# EAGLE design helmet_blinker_light_ACY_v0.1 (EAGLE 7.6.0)
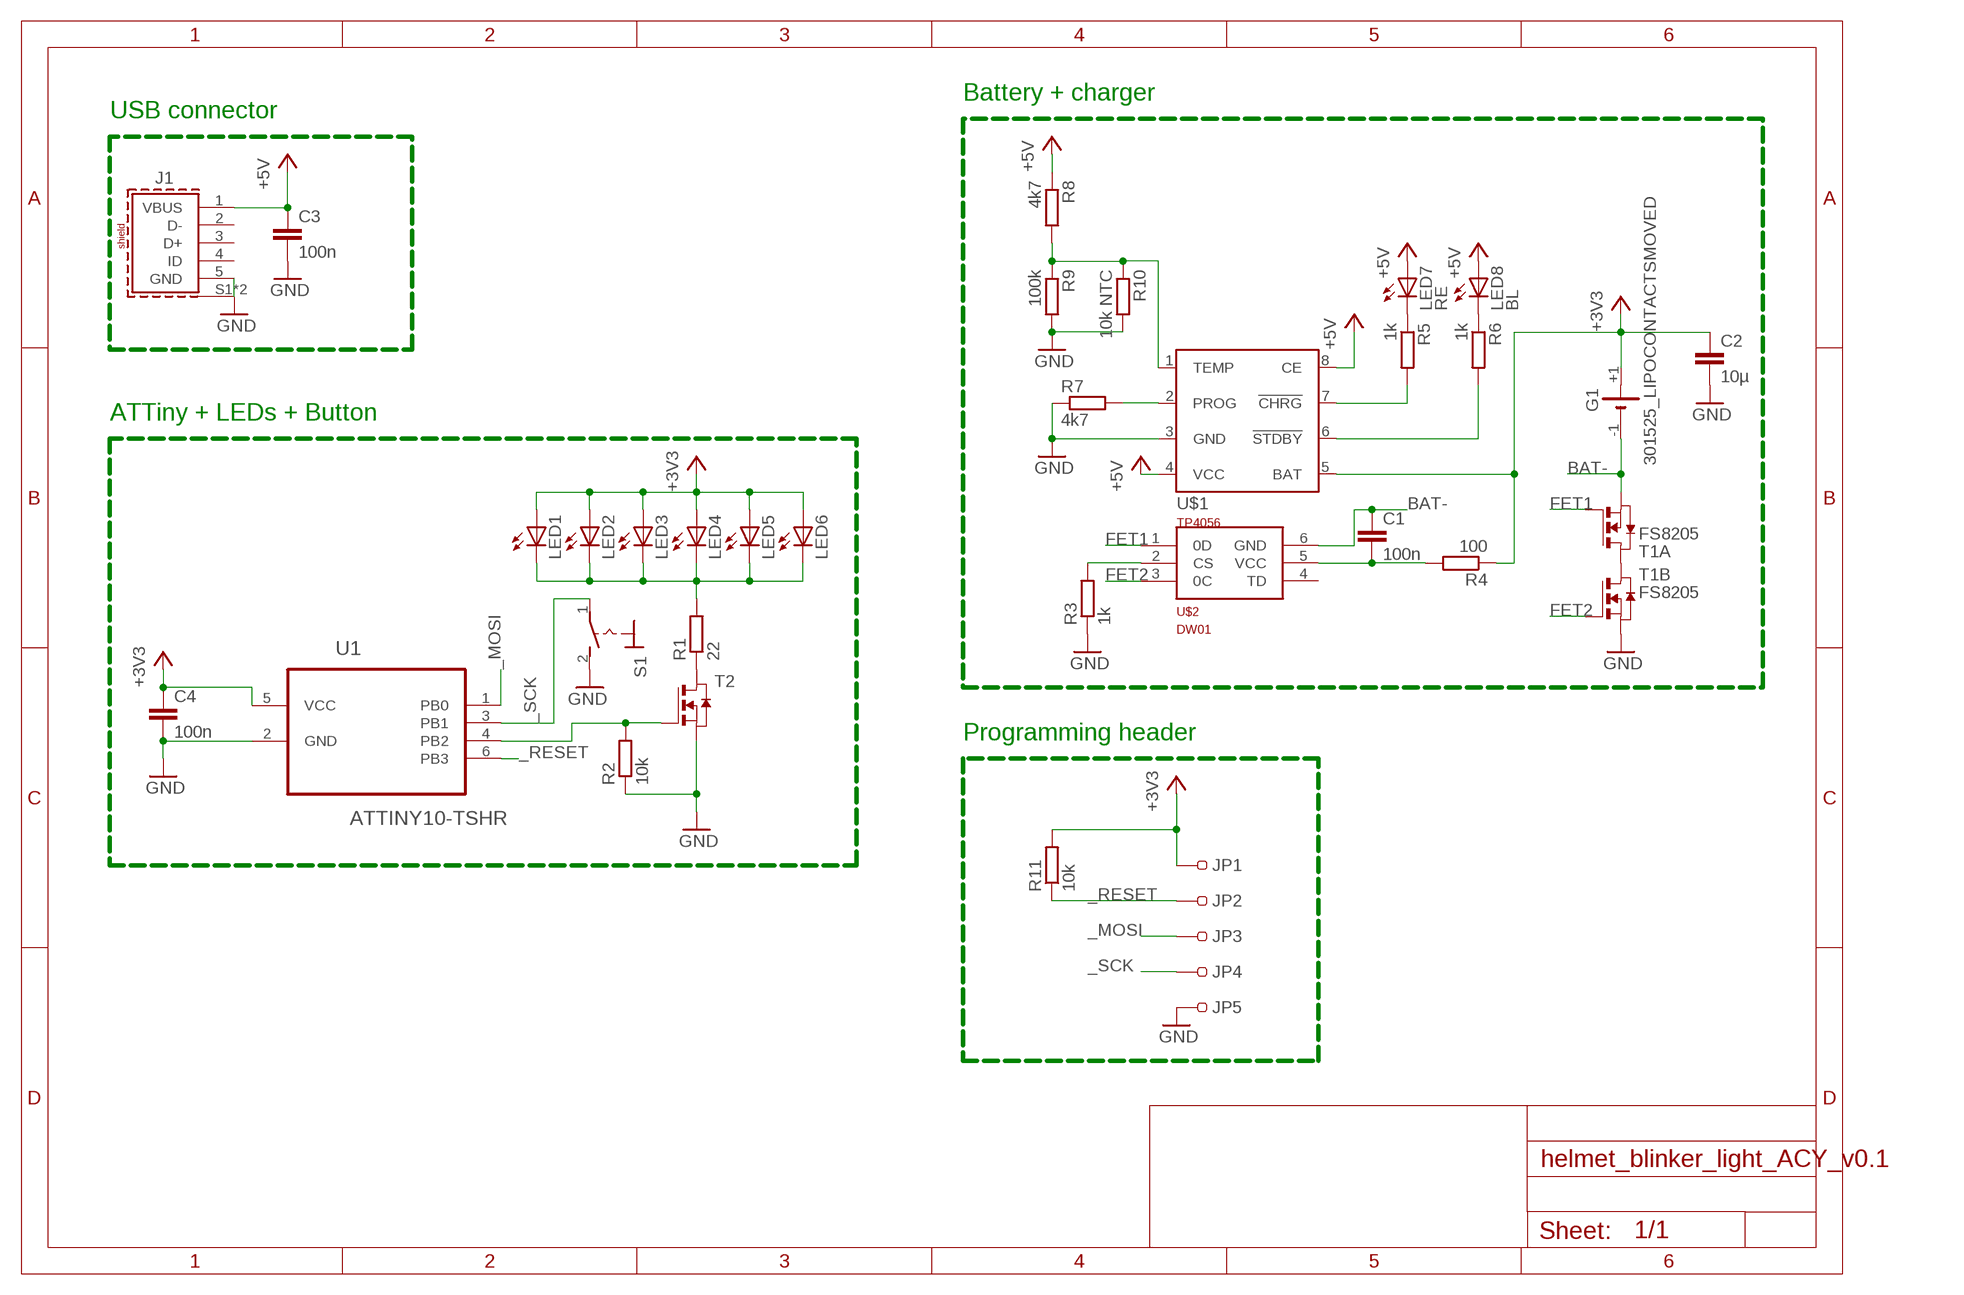
[diagram p0: schematic, sheet 1]

## Parts
C1  100n  C-EUC0402K  [C0402K]
C2  10µ  C-EUC0805K  [C0805K]
C3  100n  C-EUC0402K  [C0402K]
C4  100n  C-EUC0402K  [C0402K]
G1  301525_LIPOCONTACTSMOVED  [301525_LIPO_CONTACTSMOVED]
J1  614105150621  [614105150621]
JP1  0.7MM_POGO-PINS  [0.7MM_POGO-PINS]
JP2  0.7MM_POGO-PINS  [0.7MM_POGO-PINS]
JP3  0.7MM_POGO-PINS  [0.7MM_POGO-PINS]
JP4  0.7MM_POGO-PINS  [0.7MM_POGO-PINS]
JP5  0.7MM_POGO-PINS  [0.7MM_POGO-PINS]
LED1  LEDCHIPLED_0805  [CHIPLED_0805]
LED2  LEDCHIPLED_0805  [CHIPLED_0805]
LED3  LEDCHIPLED_0805  [CHIPLED_0805]
LED4  LEDCHIPLED_0805  [CHIPLED_0805]
LED5  LEDCHIPLED_0805  [CHIPLED_0805]
LED6  LEDCHIPLED_0805  [CHIPLED_0805]
LED7  RE  LEDCHIPLED_0603  [CHIPLED_0603]
LED8  BL  LEDCHIPLED_0603  [CHIPLED_0603]
R1  22  R-EU_R0805  [R0805]
R2  10k  R-EU_R0402  [R0402]
R3  1k  R-EU_R0402  [R0402]
R4  100  R-EU_R0402  [R0402]
R5  1k  R-EU_R0402  [R0402]
R6  1k  R-EU_R0402  [R0402]
R7  4k7  R-EU_R0402  [R0402]
R8  4k7  R-EU_R0402  [R0402]
R9  100k  R-EU_R0402  [R0402]
R10  10k NTC  R-EU_R0805  [R0805]
R11  10k  R-EU_R0402  [R0402]
S1  TS-1088  [TS-1088]
T1  FS8205  DMN3024LSD  [TSSOP-8]
T2  NMOSSOT23  [SOT-23]
U1  ATTINY10-TSHR  [SOT95P280X145-6N]
U$1  TP4056ESOP  [ESOP23-8]
U$2  DW01  [SOT23-6]

## Nets
+3V3: C2.1 C4.1 G1.+1(+) JP1.1 LED1.A LED2.A LED3.A LED4.A LED5.A LED6.A R4.1 R11.2 U1.5(VCC) U$1.5(BAT)
+5V: C3.1 J1.1(VBUS) LED7.A LED8.A R8.1 U$1.4(VCC) U$1.8(CE)
_MOSI: JP3.1 U1.1(PB0)
_RESET: JP2.1 R11.1 U1.6(PB3)
_SCK: JP4.1 S1.1(P) U1.3(PB1)
BAT-: C1.1 G1.-1(-) T1.2(A:S) T1.3(A:S) U$2.6(GND)
FET1: T1.4(A:G) U$2.1(0D)
FET2: T1.5(B:G) U$2.3(0C)
GND: C2.2 C3.2 C4.2 J1.5(GND) J1.S1(SHIELD) J1.S2(SHIELD) JP5.1 R2.1 R3.1 R7.1 R9.2 R10.2 S1.2(S) T1.6(B:S) T1.7(B:S) T2.2(S) U1.2(GND) U$1.3(GND)
N$1: T1.1(A:D) T1.8(B:D)
N$2: R1.1 T2.1(D)
N$3: R3.2 U$2.2(CS)
N$4: R2.2 T2.3(G) U1.4(PB2)
N$5: LED1.C LED2.C LED3.C LED4.C LED5.C LED6.C R1.2
N$6: C1.2 R4.2 U$2.5(VCC)
N$8: R7.2 U$1.2(PROG)
N$9: R6.2 U$1.6(!STDBY)
N$10: LED7.C R5.1
N$11: LED8.C R6.1
N$12: R5.2 U$1.7(!CHRG)
N$13: R8.2 R9.1 R10.1 U$1.1(TEMP)
Unconnected: J1.2(D-) J1.3(D+) J1.4(ID) U$2.4(TD)

## Notes on the sheet
- Battery + charger
- USB connector
- ATTiny + LEDs + Button
- Programming header

## Library data of the parts
C1-C4 = rcl:C-EU: CAPACITOR, European symbol
G1 = battery:301525_LIPO: LI BATTERY Sonnenschein
J1 = 632723300011_Eagle_WR-USB_rev20a:614105150621: WR-COM Micro USB 2.0 Type AB Vertical 5 Contacts Kind Properties Durability:10 000 Mating cycles Quality Class:10 000 Mating cycles Connector Type:Micro USB Gender:Receptacle Type:Vertical General Information Operating Temperature:-40up to +105 °C Compliance:RoHS Electrical Properties IR 1:1.8A Working Voltage:30V (AC) Withstanding Voltage:100V (AC) Contact Resistance:30 mΩ Material Properties Insulator Material:LCP Insulator Flammability Rating:UL94 V-0 Color:Black Contact Material:Copper Alloy Contact Plating: Gold Contact Type:Stamped Shielding Material:Stainless Steel Shielding Plating:Matte Tin <https://www.we-online.com/catalog/media/o33043v209%20Family_WR-COM_Micro-USB_Type-AB_614105150621.jpg> Details see: https://www.we-online.com/catalog/en/COM_MICRO_TYPE_AB_VERTICAL/ Updated by Yingchun, Shan 2020-01-16 2020 (C) Würth Elektronik; APPLICATION: Micro USB 2.0; DATASHEET-URL: https://www.we-online.com/catalog/datasheet/614105150621.pdf; GERDER: Receptacle; INTERFACE-TYPE: TypeAB; IR1: 1.8A; MOUNT: THT; PACKAGING: Tape and Reel; PART-NUMBER: 614105150621; PINS: 5; TYPE: Vertical; WORKING-VOLTAGE: 30V(AC)
JP1-JP5 = pinhead:0.7MM_POGO-PINS: PIN HEADER
LED1-LED8 = led:LED: LED OSRAM: - CHIPLED LG R971, LG N971, LY N971, LG Q971, LY Q971, LO R971, LY R971 LH N974, LH R974 LS Q976, LO Q976, LY Q976 LO Q996 - Hyper CHIPLED LW Q18S LB Q993, LB Q99A, LB R99A - SideLED LS A670, LO A670, LY A670, LG A670, LP A670 LB A673, LV A673, LT A673, LW A673 LH A674 LY A675 LS A676, LA A676, LO A676, LY A676, LW A676 LS A679, LY A679, LG A679 - Hyper Micro SIDELED® LS Y876, LA Y876, LO Y876, LY Y876 LT Y87S - SmartLED LW L88C, LW L88S LB L89C, LB L89S, LG L890 LS L89K, LO L89K, LY L89K LS L896, LA L896, LO L896, LY L896 - TOPLED LS T670, LO T670, LY T670, LG T670, LP T670 LSG T670, LSP T670, LSY T670, LOP T670, LYG T670 LG T671, LOG T671, LSG T671 LB T673, LV T673, LT T673, LW T673 LH T674 LS T676, LA T676, LO T676, LY T676, LB T676, LH T676, LSB T676, LW T676 LB T67C, LV T67C, LT T67C, LS T67K, LO T67K, LY T67K, LW E67C LS E67B, LA E67B, LO E67B, LY E67B, LB E67C, LV E67C, LT E67C LW T67C LS T679, LY T679, LG T679 LS T770, LO T770, LY T770, LG T770, LP T770 LB T773, LV T773, LT T773, LW T773 LH T774 LS E675, LA E675, LY E675, LS T675 LS T776, LA T776, LO T776, LY T776, LB T776 LHGB T686 LT T68C, LB T68C - Hyper Mini TOPLED® LB M676 - Mini TOPLED Santana® LG M470 LS M47K, LO M47K, LY M47K Source: http://www.osram.convergy.de LUXEON: - LUMILED® LXK2-PW12-R00, LXK2-PW12-S00, LXK2-PW14-U00, LXK2-PW14-V00 LXK2-PM12-R00, LXK2-PM12-S00, LXK2-PM14-U00 LXK2-PE12-Q00, LXK2-PE12-R00, LXK2-PE12-S00, LXK2-PE14-T00, LXK2-PE14-U00 LXK2-PB12-K00, LXK2-PB12-L00, LXK2-PB12-M00, LXK2-PB14-N00, LXK2-PB14-P00, LXK2-PB14-Q00 LXK2-PR12-L00, LXK2-PR12-M00, LXK2-PR14-Q00, LXK2-PR14-R00 LXK2-PD12-Q00, LXK2-PD12-R00, LXK2-PD12-S00 LXK2-PH12-R00, LXK2-PH12-S00 LXK2-PL12-P00, LXK2-PL12-Q00, LXK2-PL12-R00 Source: www.luxeon.com KINGBRIGHT: KA-3528ASYC Source: www.kingbright.com
R1-R11 = rcl:R-EU_: RESISTOR, European symbol
S1 = switch:TS-1088: TOGGLE SWITCH Button TS-1088 https://lcsc.com/product-detail/Tactile-Switches_XUNPU-TS-1088-AR02016_C720477.html/?href=jlc-SMT https://lcsc.com/product-detail/Tactile-Switches_Korean-Hroparts-Elec-K2-1807SA-B4DW-06_C223822.html LCSC (JLCPCB): C720477 LCSC (JLCPCB): C223822
T1 = FS8205A:DMN3024LSD: DUAL N-CHANNEL ENHANCEMENT MODE MOSFET data sheet <http://goo.gl/dRgboR> Dave.Calaway Eagle Library <https://goo.gl/Muy1Tr>
T2 = zetex:NMOSSOT23: MOS FET; OC_FARNELL: unknown; OC_NEWARK: unknown
U1 = Atmel_By_element14_Batch_1-00:ATTINY10-TSHR: 8-bit Microcontroller with In-System Programmable Flash; MPN: ATTINY10-TSHR; OC_FARNELL: 1748538; OC_NEWARK: 26R5645; PACKAGE: SOT-23-6; SUPPLIER: Atmel
U$1 = TP4056:TP4056: TP4056 Data sheet <http://goo.gl/J7k8TF> Dave.Calaway Eagle Library <https://goo.gl/Muy1Tr>
U$2 = DW01:DW01: The DW01-P battery protection IC is designed to protect lithium-ion/polymer battery from damage or degrading the lifetime due to overcharge, overdischarge, and/or overcurrent for one-cell lithium-ion/polymer battery powered systems, such as cellular phones. Data sheet <http://goo.gl/4y108d> Dave.Calaway Eagle Library <https://goo.gl/Muy1Tr>

## Board
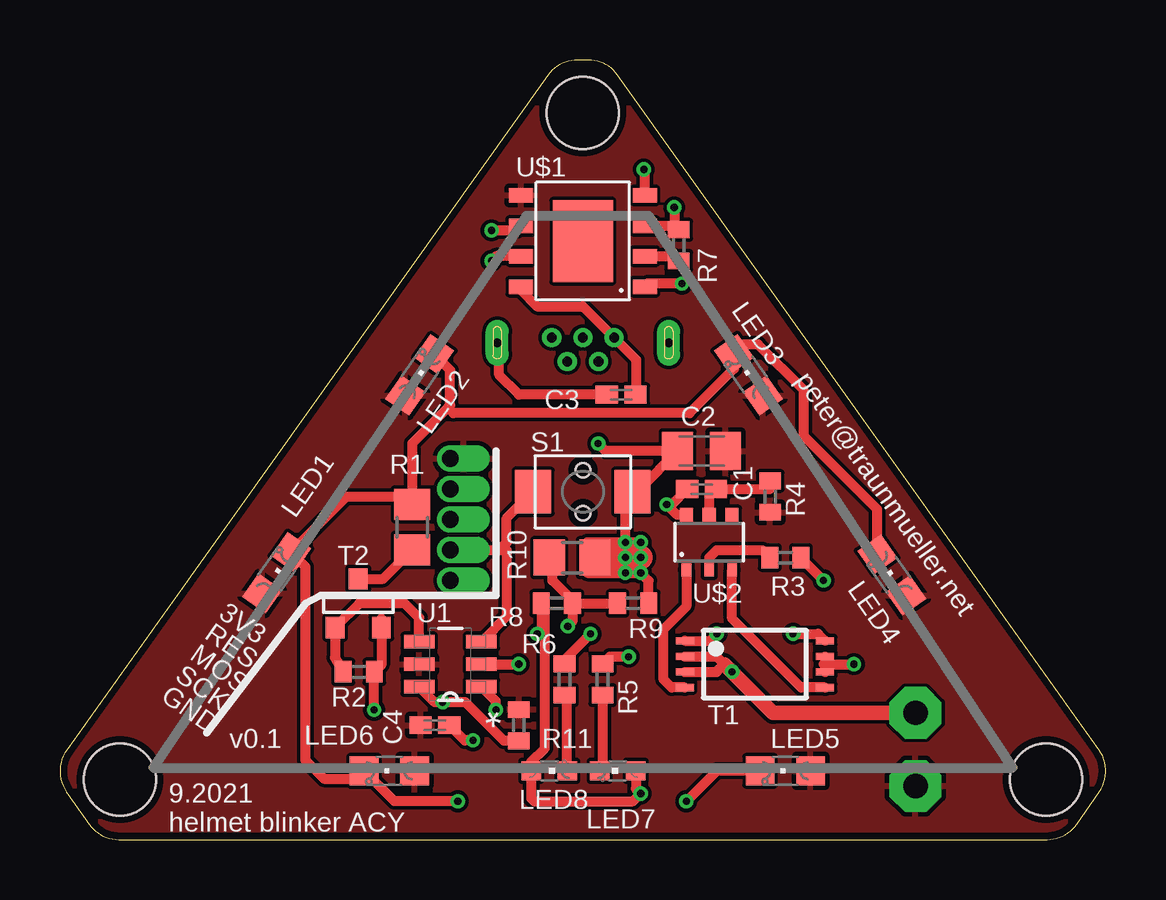
[diagram p1: board, top side]
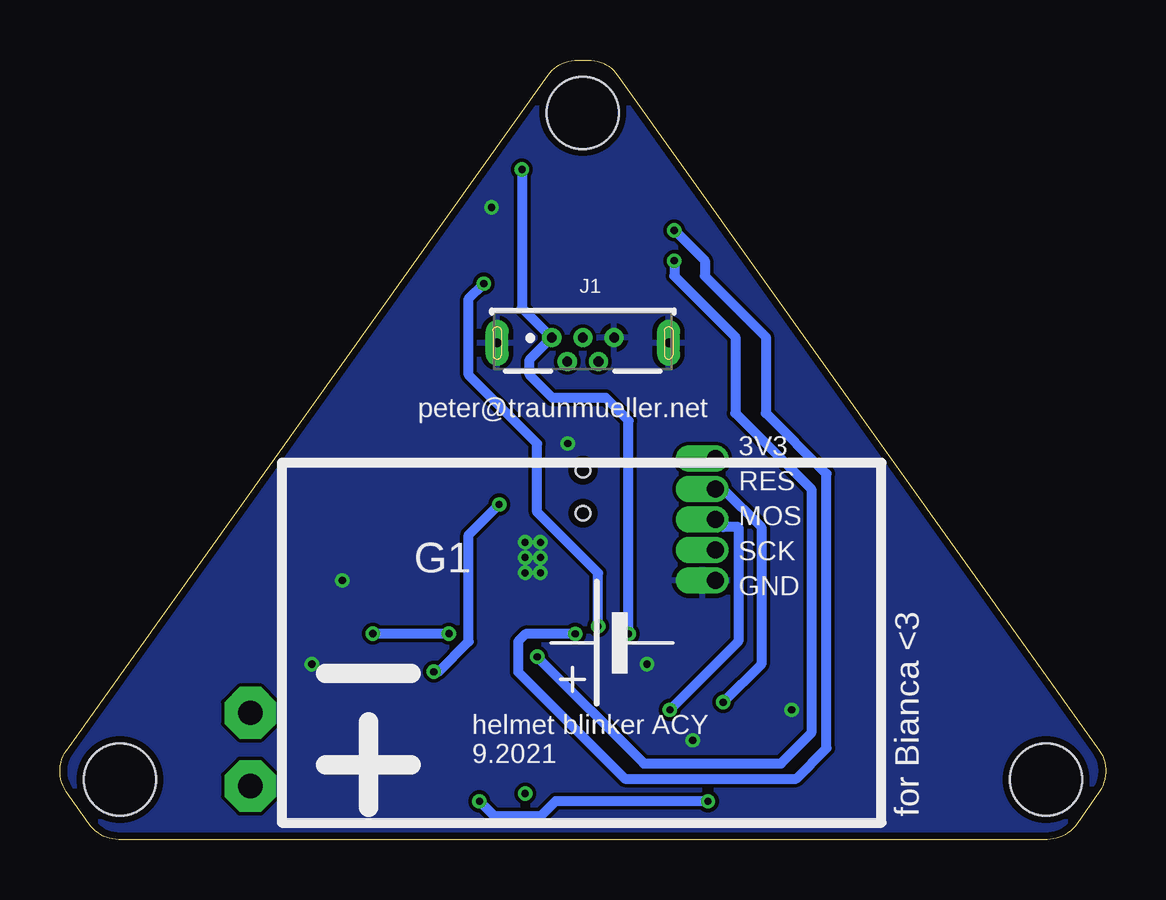
[diagram p2: board, bottom side, seen from below]

Size 43.6 x 32.5 mm. Coordinates in mm from the lower left corner, seen from the top.
Outline: 20.35,31.87 0.28,3.73 arc70 0.27,2 1.21,0.64 arc55 2.44,0 41.15,0 arc55 42.38,0.64 43.33,2 arc70 43.32,3.73 23.25,31.87 arc55 22.02,32.5 21.57,32.5 arc55 20.35,31.87
Copper layers (1*16): Top 0.035mm / dielectric 1.5mm / Bottom 0.035mm
Design rules "PCB-POOL Standard": minimum track width 0.15mm, minimum drill 0.3mm, track to track 0.15mm, track to pad 0.15mm, pad to pad 0.15mm, via to via 0.15mm, smd to smd 0.15mm, copper to edge 0.3mm, drill to drill 0.2mm, minimum pad ring 0.2mm, minimum via ring 0.15mm, stop-mask expansion 0.075mm, vias tented up to drill 0mil, thermal gap 0.2mm
Holes 3 mm at 41.1,2.5 2.5,2.5 21.8,30.3

### Footprints (pad centres in the part's own frame; a part is rotated, then mirrored left to right if it is on the bottom)
C0402K = smd 0.925 x 0.74: 1 -0.6,0; 2 0.6,0
C0805K = smd 1.3 x 1.6: 1 -1,0; 2 1,0
301525_LIPO_CONTACTSMOVED = drill 1.016 pad 2.159 octagon: +1 -13.81,-5.97; -1 -13.81,-2.92
614105150621 = drill 0.4: 1 -1.3,0.125; 2 -0.65,-0.875; 3 0,0.125; 4 0.65,-0.875; 5 1.3,0.125 | drill 0.35 pad 0.95 long: S1 -3.575,-0.095; S2 3.575,-0.095
0.7MM_POGO-PINS = drill 0.7 pad 0.85 offset: 1 0,0
CHIPLED_0805 = smd 1.2 x 1.2: A 0,-1.05; C 0,1.05
CHIPLED_0603 = smd 0.8 x 0.8: A 0,-0.75; C 0,0.75
R0805 = smd 1.3 x 1.5: 1 -0.95,0; 2 0.95,0
R0402 = smd 0.7 x 0.9: 1 -0.65,0; 2 0.65,0
TS-1088 = smd 1.5 x 1.8: 1 -2.075,0; 2 2.075,0 | hole 0.6: 0,0.9; 0,-0.9
TSSOP-8 = smd 0.3 x 0.75: 1 -0.975,-2.925; 2 -0.325,-2.925; 3 0.325,-2.925; 4 0.975,-2.925; 5 0.975,2.925; 6 0.325,2.925; 7 -0.325,2.925; 8 -0.975,2.925
SOT-23 = smd 0.787 x 0.889: 1 0.025,-1.016; 2 -0.94,1.016; 3 0.991,1.016
SOT95P280X145-6N = smd 1.27 x 0.559: 1 -1.295,0.94; 2 -1.295,0; 3 -1.295,-0.94; 4 1.295,-0.94; 5 1.295,0; 6 1.295,0.94
ESOP23-8 = smd 0.6 x 1: 1 -1.905,-2.58; 2 -0.635,-2.58; 3 0.635,-2.58; 4 1.905,-2.58; 5 1.905,2.58; 6 0.635,2.58; 7 -0.635,2.58; 8 -1.905,2.58 | smd 3.4 x 2.5: P$1 0,0
SOT23-6 = smd 0.4 x 0.55: 1 -0.95,-1.15; 2 0,-1.15; 3 0.95,-1.15 | smd 0.55 x 0.55: 4 0.95,1.15; 5 0,1.15; 6 -0.95,1.15

### Placement (x,y rotation side)
C1  26.75,14.61 0 top
C2  26.75,16.2 180 top
C3  23.39,18.55 180 top
C4  15.63,4.77 0 top
G1  21.85,8.2 0 bottom
J1  21.8,20.8 0 bottom
JP1  16.27,15.88 0 top
JP2  16.27,14.61 0 top
JP3  16.27,13.34 0 top
JP4  16.27,12.07 0 top
JP5  16.27,10.8 0 top
LED1  9.03,11.12 325 top
LED2  15,19.38 325 top
LED3  28.7,19.38 35 top
LED4  34.67,11.03 35 top
LED5  30.24,2.87 90 top
LED6  13.73,2.87 90 top
LED7  23.25,2.87 90 top
LED8  20.4,2.87 270 top
R1  14.68,13.03 90 top
R2  12.46,6.99 180 top
R3  30.24,11.76 180 top
R4  29.6,14.29 90 top
R5  22.62,6.67 90 top
R6  21.03,6.67 90 top
R7  25.79,24.77 270 top
R8  20.71,9.85 0 top
R9  23.89,9.85 0 top
R10  21.35,11.76 0 top
R11  19.13,4.77 90 top
S1  21.8,14.5 0 top
T1  28.97,7.31 270 top
T2  12.46,9.85 180 top
U1  16.27,7.31 180 top
U$1  21.8,24.95 90 top
U$2  27.06,12.39 0 top

### Tracks (layer width: path | path; a pad name or v marks a point on that pad's centre or on a via)
+3V3
  Bottom 0.406: JP1.1 15.95,15.88
  pour Top: 16.81,33.03 -9.86,3.5 -4.78,-1.58 43.52,-1.58 47.24,4.13 44.11,11.12 24.43,33.66
+5V  (via drill 0.3)
  Top 0.406: LED7.A 24,2.12 v24.21,1.91 23.89,1.59 19.76,1.59 19.65,1.71 LED8.A 19.65,3.25 20.21,3.81 20.21,9.7 R8.1 20.06,8.74 v19.89,8.57 | U$1.8 19.22,22.9 19.89,22.23 21.8,22.23 J1.1 24.02,20 24.02,18.57 C3.1 24.02,18.52 | U$1.4 24.38,27.9 v24.34,27.94
  Bottom 0.406: v19.89,8.57 19.89,17.46 20.84,18.41 23.07,18.41 24.02,19.37 24.02,20 J1.1 24.34,22.16 v24.34,27.94
_MOSI  (via drill 0.3)
  Top 0.406: v18.17,5.41 18.17,5.76 U1.1
  Bottom 0.406: v18.17,5.41 15.32,8.26 15.32,13.03 15.95,13.03 JP3.1
_RESET  (via drill 0.3)
  Top 0.406: U1.6 15.62,5.72 v15.95,5.72 16.9,5.72 18.51,4.12 R11.1
  Bottom 0.406: JP2.1 15.95,14.61 14.36,13.03 14.36,7.31 v15.95,5.72
_SCK
  Top 0.406: S1.1 18.62,13.4 18.62,12.38 18.31,12.07 JP4.1 18.3,12.07 18.3,12.06 18.62,12.06 18.62,9.31 U1.3
BAT-  (via drill 0.3)
  Top 0.406: T1.2 27.37,7.63 27.7,7.31 27.37,6.99 T1.3 | C1.1 25.5,13.97 v25.29,13.97 25.72,13.54 U$2.6
  Top 0.61: 27.7,7.31 v28.02,6.99 29.73,5.28 G1.-1
  Bottom 0.406: v28.02,6.99 27.82,6.99 26.56,8.26 26.56,12.7 v25.29,13.97
FET1
  Top 0.406: T1.4 25.5,6.33 25.16,6.67 25.16,8.76 26.11,9.71 U$2.1
FET2
  Top 0.406: T1.5 30.9,6.33 28.02,9.21 U$2.3
GND  (via drill 0.3)
  Top 0.406: 13.4,9.2 T2.2 13.4,7.28 R2.1 13.09,6.69 v13.09,5.41 | U1.2 v19.13,7.31 | T1.6 T1.7 31.89,7.38 31.82,7.31 v33.09,7.31 | R3.1 30.89,11.74 v31.82,10.8 | R10.2 22.62,11.76 v23.57,11.76 24.21,11.44 v24.21,11.12 | v23.57,12.39 v24.21,12.39 v24.21,11.76 v24.21,11.12 | v23.57,12.39 21.98,12.39 21.98,11.12 v24.21,11.12 | v17.22,4.13 16.87,4.13 C4.2 | R9.2 24.54,10.79 v24.21,11.12 | U$1.3 25.63,25.59 | 25.63,25.59 R7.1 | 25.63,25.59 25.63,26.33 v25.61,26.35 | v22.43,16.51 22.74,16.2 C2.2 24.19,14.64 23.87,14.64 S1.2 23.57,14.2 v23.57,12.39 | C3.2 19.13,18.55 18.3,19.37 18.3,20.62 J1.S2
  Top 1.016: v24.21,11.76 22.62,11.76
  other vias: 23.57,11.12
  pour Bottom: 16.17,33.03 -9.86,4.77 -9.86,3.5 -4.78,-1.58 44.77,-2.21 48.49,3.51 44.11,11.12 24.43,33.03
N$1  (via drill 0.3)
  Top 0.406: T1.1 27.08,8.29 v27.38,8.58 | v30.56,8.58 31.6,8.58 T1.8
  Bottom 0.406: v27.38,8.58 v30.56,8.58
N$2
  Top 0.406: T2.1 13.47,10.87 R1.1
N$3
  Top 0.406: R3.2 29.27,12.07 27.38,12.07 27.06,11.76 U$2.2
N$4
  Top 0.406: R2.2 11.47,7.57 T2.3 12.48,9.85 14.36,9.85 14.97,9.24 U1.4
N$5  (via drill 0.3)
  Top 0.406: 16.04,20.23 LED2.C 16.27,19.57 16.27,18.11 16.17,18.01 | 16.17,18.01 14.68,16.52 R1.2 14.36,14.29 11.94,14.29 LED1.C 10.24,11.38 10.24,3.31 11,2.54 12.35,2.54 LED6.C 13.95,1.59 v16.58,1.59 | LED5.C 27.38,2.87 v26.11,1.59 | 16.17,18.01 16.4,17.78 26.24,17.78 28.1,19.63 LED3.C 28.5,20.64 29.1,20.64 31,18.73 31,16.83 34.07,13.77 LED4.C
  Bottom 0.406: v16.58,1.59 22.93,1.59 23.57,0.96 25.48,0.96 v26.11,1.59
N$6
  Top 0.406: R4.2 29.59,14.61 C1.2 27.06,14.33 U$2.5
N$8
  Top 0.406: U$1.2 25.6,24.32 R7.2
N$9  (via drill 0.3)
  Top 0.406: R6.2 21.03,7.49 v22.12,8.57 | v17.99,25.4 19.03,25.4 U$1.6
  Bottom 0.406: v17.99,25.4 16.72,24.13 16.72,23.5 14.18,20.95 14.18,17.78 11.64,15.24 11.64,3.81 12.91,2.54 20.05,2.54 24.5,6.99 24.5,8.26 24.18,8.57 v22.12,8.57
N$10
  Top 0.406: R5.1 22.62,2.98 LED7.C
N$11
  Top 0.406: LED8.C 21.15,5.91 R6.1
N$12  (via drill 0.3)
  Top 0.406: U$1.7 18.17,24.32 v17.99,24.13 | v23.7,7.62 22.91,7.62 R5.2
  Bottom 0.406: v23.7,7.62 19.26,3.17 13.54,3.17 12.27,4.45 12.27,14.61 15.45,17.78 15.45,20.95 17.99,23.5 v17.99,24.13
N$13  (via drill 0.3)
  Top 0.406: 20.71,11.76 R10.1 20.53,11.62 20.53,10.79 21.36,9.96 R8.2 | R8.2 R9.1 | R8.2 21.36,9.09 v21.16,8.89 | v25.93,23.18 24.51,23.18 U$1.1
  Bottom 0.406: v21.16,8.89 21.16,11.11 23.7,13.65 23.7,16.51 26.56,19.37 26.56,22.54 v25.93,23.18

### Text on the board
tPlace: peter@traunmueller.net | 3V3 / RES / MOS / SCK / GND | v0.1 | 9.2021 / helmet blinker ACY
bPlace: peter@traunmueller.net | for Bianca <3 | 3V3 / RES / MOS / SCK / GND | helmet blinker ACY / 9.2021